# Altium schematic sheet 5VRegulator.SchDoc
size B; SheetNumber: 6; SheetTotal: 6
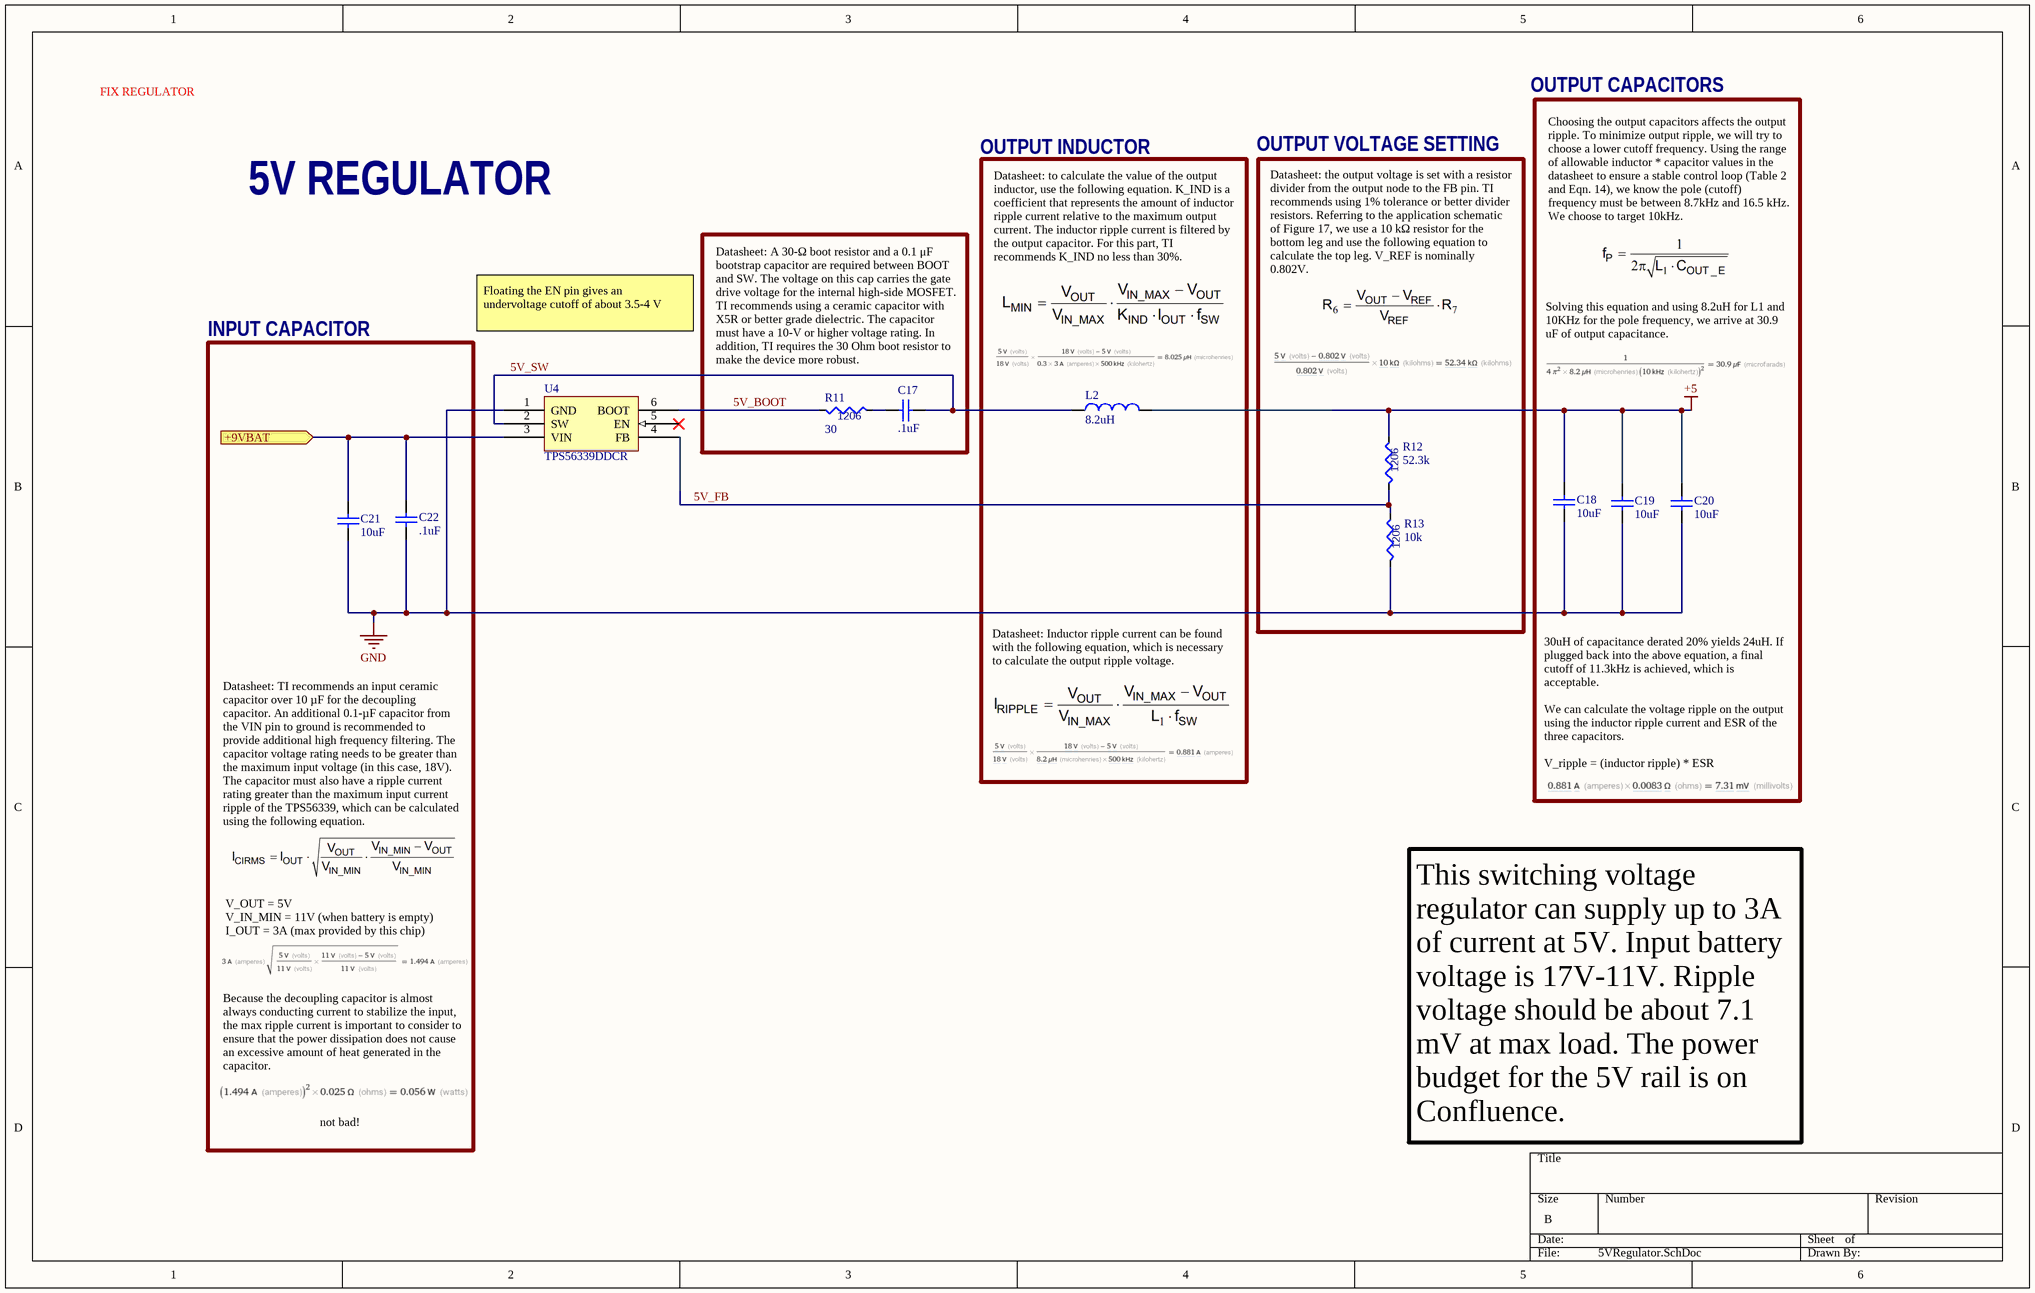
[diagram p0: 5VRegulator.SchDoc]

## Parts
C17  .1uF  [C1206]
C18  10uF  [C1206]
C19  10uF  [C1206]
C20  10uF  [C1206]
C21  10uF  [C1206]
C22  .1uF  [C1206]
L2  8.2uH  [EATON_HCMA0703]
R11  30  [R1206]
R12  52.3k  [R1206]
R13  10k  [R1206]
U4  TPS56339DDCR  [TSOT-23-6]

## Blocks framed on the sheet
OUTPUT INDUCTOR: L2
OUTPUT VOLTAGE SETTING: R12 R13
INPUT CAPACITOR: C21 C22

## Ports
+9VBAT (in)

## Nets
+5: C18.2 C19.2 C20.2 L2.2 R12.2
GND: C18.1 C19.1 C20.1 C21.1 C22.1 R13.1 U4.1(GND)
5V_BOOT: R11.1 U4.6(BOOT)
5V_FB: R12.1 R13.2 U4.4(FB)
5V_SW: C17.2 L2.1 U4.2(SW)
+9VBAT: C21.2 C22.2 U4.3(VIN) ; port +9VBAT
NetC17_1: C17.1 R11.2

Not connected (* = marked no-connect by the designer): U4 5(EN)*

## Notes on the sheet
- FIX REGULATOR
- OUTPUT CAPACITORS
- 5V REGULATOR
- Choosing the output capacitors affects the output ripple. To minimize output ripple, we will try to choose a lower cutoff frequency. Using the range of allowable inductor * capacitor values in the datasheet to ensure a stable control loop (Table 2 and Eqn. 14), we know the pole (cutoff) frequency must be between 8.7kHz and 16.5 kHz. We choose to target 10kHz.
- Datasheet: to calculate the value of the output inductor, use the following equation. K_IND is a coefficient that represents the amount of inductor ripple current relative to the maximum output current. The inductor ripple current is filtered by the output capacitor. For this part, TI recommends K_IND no less than 30%.
- Datasheet: the output voltage is set with a resistor divider from the output node to the FB pin. TI recommends using 1% tolerance or better divider resistors. Referring to the application schematic of Figure 17, we use a 10 kΩ resistor for the bottom leg and use the following equation to calculate the top leg. V_REF is nominally 0.802V.
- Floating the EN pin gives an undervoltage cutoff of about 3.5-4 V
- Datasheet: A 30-Ω boot resistor and a 0.1 μF bootstrap capacitor are required between BOOT and SW. The voltage on this cap carries the gate drive voltage for the internal high-side MOSFET. TI recommends using a ceramic capacitor with X5R or better grade dielectric. The capacitor must have a 10-V or higher voltage rating. In addition, TI requires the 30 Ohm boot resistor to make the device more robust.
- Solving this equation and using 8.2uH for L1 and 10KHz for the pole frequency, we arrive at 30.9 uF of output capacitance.
- Datasheet: Inductor ripple current can be found with the following equation, which is necessary to calculate the output ripple voltage.
- 30uH of capacitance derated 20% yields 24uH. If plugged back into the above equation, a final cutoff of 11.3kHz is achieved, which is acceptable.
  We can calculate the voltage ripple on the output using the inductor ripple current and ESR of the three capacitors.
  V_ripple = (inductor ripple) * ESR
- Datasheet: TI recommends an input ceramic capacitor over 10 µF for the decoupling capacitor. An additional 0.1-µF capacitor from the VIN pin to ground is recommended to provide additional high frequency filtering. The capacitor voltage rating needs to be greater than the maximum input voltage (in this case, 18V). The capacitor must also have a ripple current rating greater than the maximum input current ripple of the TPS56339, which can be calculated using the following equation.
- V_OUT = 5V
  V_IN_MIN = 11V (when battery is empty)
  I_OUT = 3A (max provided by this chip)
- Because the decoupling capacitor is almost always conducting current to stabilize the input, the max ripple current is important to consider to ensure that the power dissipation does not cause an excessive amount of heat generated in the capacitor.
- not bad!
- This switching voltage regulator can supply up to 3A of current at 5V. Input battery voltage is 17V-11V. Ripple voltage should be about 7.1 mV at max load. The power budget for the 5V rail is on Confluence.
- (in symbol ERA-8AEB5232V) 1206
- (in symbol ERA-8AHD300V) 1206
- (in symbol ERJ-8ENF1002V) 1206

## Library data of the parts
C17 C22 = CL31B104KBCNNNC: CAP CER 0.1UF 50V C0G/NP0 1206; Made By: Brennan Swanton; Reviewed By: Carter Allen; Supplier 1: Digi-Key; Supplier Part Number 1: 490-8335-1-ND
C18-C21 = CL31B106KLHNNNE: CER 10UF 35V X7R 1206; Made By: Brennan Swanton; Reviewed By: Carter Allen; Supplier 1: Digi-Key; Supplier Part Number 1: 587-3007-1-ND
L2 = HCMA0703-8R2-R: Inductor 8.2uH 4A 20%; Supplier 1: Digi-Key; Supplier Part Number 1: 283-4539-1-ND
R11 = ERA-8AHD300V: RES SMD 30 OHM 0.5% 1/4W 1206; Made By: Jamie; Reviewed By: Raphael; Supplier 1: Digi-Key; Supplier Part Number 1: P123726CT-ND
R12 = ERA-8AEB5232V: RES SMD 52.3K OHM 0.1% 1/4W 1206; Made By: Raphael Navarro; Reviewed By: Jamie Smith; Supplier 1: Digi-Key; Supplier Part Number 1: P52.3KBCCT-ND
R13 = ERJ-8ENF1002V: 10K OHM 1% 1/4W 1206; Made By: Brennan Swanton; Reviewed By: Carter Allen; Supplier 1: Digi-Key; Supplier Part Number 1: 541-2247-1-ND
U4 = TPS56339DDCR: Buck Regulator IC Adj. 3A 4.5V-24V Input; Supplier 1: Digi-Key; Supplier Part Number 1: 296-53568-1-ND